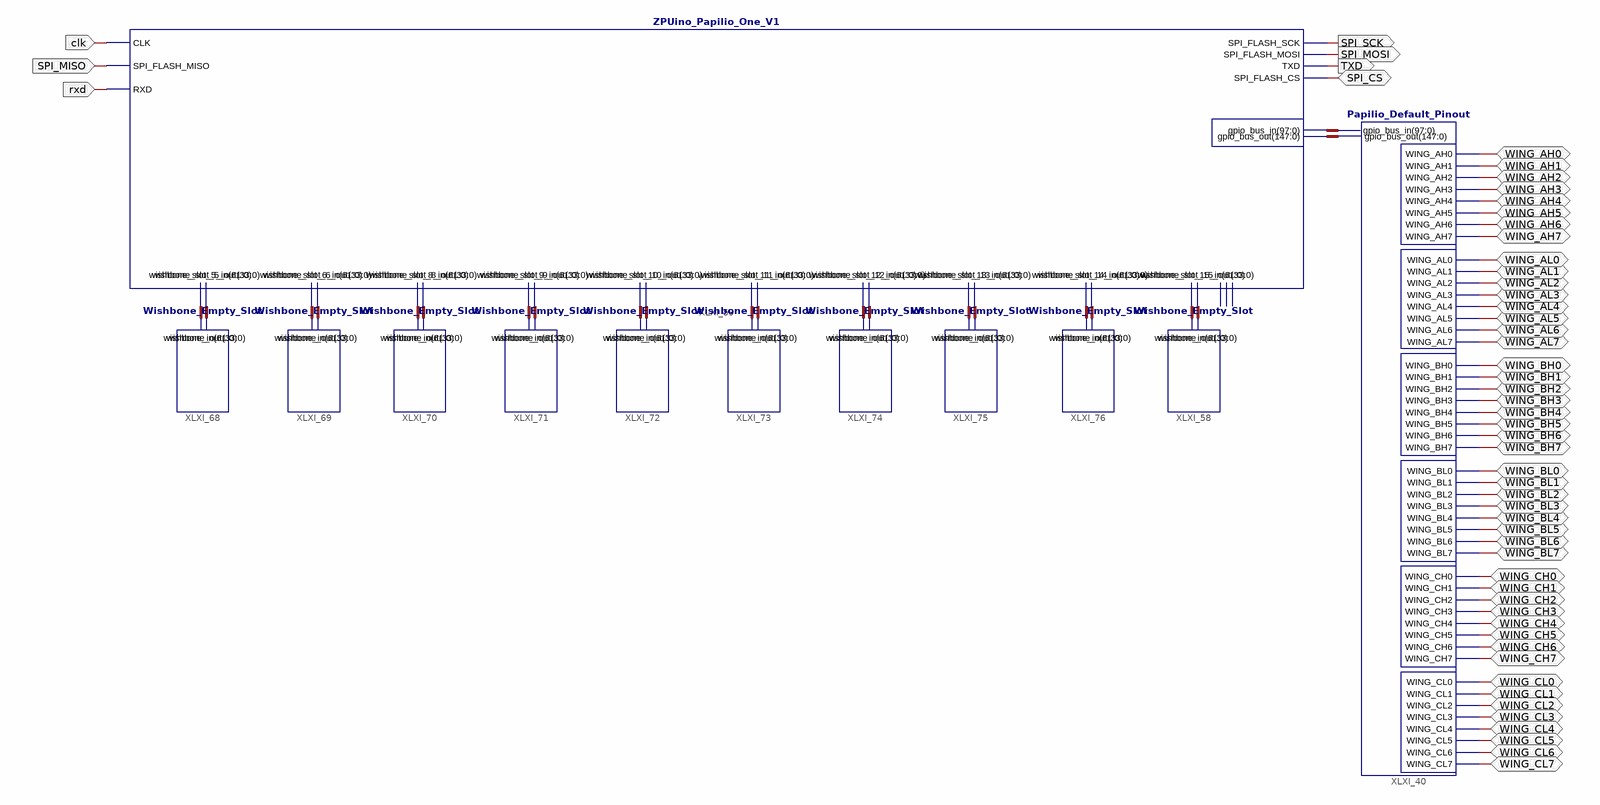
[diagram p0: schematic sheet 1]
// Xilinx ISE schematic Papilio_SOC_Base.sch (spartan3e) as structural Verilog: 12 symbols, 55 ports
module Papilio_SOC_Base (
  input  clk,
  input  SPI_MISO,
  input  rxd,
  inout  SPI_CS,
  inout  WING_AH0,
  inout  WING_AH1,
  inout  WING_AH2,
  inout  WING_AH3,
  inout  WING_AH4,
  inout  WING_AH5,
  inout  WING_AH6,
  inout  WING_AH7,
  inout  WING_BL7,
  inout  WING_BL6,
  inout  WING_BL5,
  inout  WING_BL4,
  inout  WING_BL3,
  inout  WING_BL2,
  inout  WING_BL1,
  inout  WING_BL0,
  inout  WING_BH7,
  inout  WING_BH6,
  inout  WING_BH5,
  inout  WING_BH4,
  inout  WING_BH3,
  inout  WING_BH2,
  inout  WING_BH1,
  inout  WING_BH0,
  inout  WING_AL7,
  inout  WING_AL6,
  inout  WING_AL5,
  inout  WING_AL4,
  inout  WING_AL3,
  inout  WING_AL2,
  inout  WING_AL1,
  inout  WING_AL0,
  inout  WING_CH0,
  inout  WING_CH1,
  inout  WING_CH2,
  inout  WING_CH3,
  inout  WING_CH4,
  inout  WING_CH5,
  inout  WING_CH6,
  inout  WING_CH7,
  inout  WING_CL0,
  inout  WING_CL1,
  inout  WING_CL2,
  inout  WING_CL3,
  inout  WING_CL4,
  inout  WING_CL5,
  inout  WING_CL6,
  inout  WING_CL7,
  output SPI_MOSI,
  output TXD,
  output SPI_SCK
);

  wire [33:0] XLXN_386, XLXN_420, XLXN_422, XLXN_424, XLXN_426, XLXN_428, XLXN_430, XLXN_432, XLXN_434,
       XLXN_436;
  wire [61:0] XLXN_385, XLXN_419, XLXN_421, XLXN_423, XLXN_425, XLXN_427, XLXN_429, XLXN_431, XLXN_433,
       XLXN_435;
  wire [97:0] XLXN_195;
  wire [147:0] XLXN_194;

  Papilio_Default_Pinout XLXI_40 (
    .WING_AH0(WING_AH0), .gpio_bus_out(XLXN_194), .gpio_bus_in(XLXN_195), .WING_AH1(WING_AH1),
    .WING_AH2(WING_AH2), .WING_AH3(WING_AH3), .WING_AH4(WING_AH4), .WING_AH5(WING_AH5), .WING_AH6(WING_AH6),
    .WING_AH7(WING_AH7), .WING_AL0(WING_AL0), .WING_AL1(WING_AL1), .WING_AL2(WING_AL2), .WING_AL3(WING_AL3),
    .WING_AL4(WING_AL4), .WING_AL5(WING_AL5), .WING_AL6(WING_AL6), .WING_AL7(WING_AL7), .WING_BH0(WING_BH0),
    .WING_BH1(WING_BH1), .WING_BH2(WING_BH2), .WING_BH3(WING_BH3), .WING_BH4(WING_BH4), .WING_BH5(WING_BH5),
    .WING_BH6(WING_BH6), .WING_BH7(WING_BH7), .WING_BL0(WING_BL0), .WING_BL1(WING_BL1), .WING_BL2(WING_BL2),
    .WING_BL3(WING_BL3), .WING_BL4(WING_BL4), .WING_BL5(WING_BL5), .WING_BL6(WING_BL6), .WING_BL7(WING_BL7),
    .WING_CH0(WING_CH0), .WING_CH1(WING_CH1), .WING_CH2(WING_CH2), .WING_CH3(WING_CH3), .WING_CH4(WING_CH4),
    .WING_CH5(WING_CH5), .WING_CH6(WING_CH6), .WING_CH7(WING_CH7), .WING_CL0(WING_CL0), .WING_CL1(WING_CL1),
    .WING_CL2(WING_CL2), .WING_CL3(WING_CL3), .WING_CL4(WING_CL4), .WING_CL5(WING_CL5), .WING_CL6(WING_CL6),
    .WING_CL7(WING_CL7));
  Wishbone_Empty_Slot XLXI_58 (.wishbone_in(XLXN_385), .wishbone_out(XLXN_386));
  ZPUino_Papilio_One_V1 XLXI_59 (
    .wishbone_slot_8_in(XLXN_423), .wishbone_slot_8_out(XLXN_424), .wishbone_slot_9_in(XLXN_425),
    .wishbone_slot_9_out(XLXN_426), .wishbone_slot_10_in(XLXN_427), .wishbone_slot_10_out(XLXN_428),
    .wishbone_slot_11_in(XLXN_429), .wishbone_slot_11_out(XLXN_430), .wishbone_slot_12_in(XLXN_431),
    .wishbone_slot_12_out(XLXN_432), .wishbone_slot_13_in(XLXN_433), .wishbone_slot_13_out(XLXN_434),
    .wishbone_slot_14_in(XLXN_435), .wishbone_slot_14_out(XLXN_436), .wishbone_slot_15_in(XLXN_385),
    .wishbone_slot_15_out(XLXN_386), .wishbone_slot_5_out(XLXN_420), .wishbone_slot_5_in(XLXN_419),
    .wishbone_slot_6_in(XLXN_421), .wishbone_slot_6_out(XLXN_422), .SPI_FLASH_SCK(SPI_SCK),
    .SPI_FLASH_MOSI(SPI_MOSI), .TXD(TXD), .SPI_FLASH_CS(SPI_CS), .gpio_bus_out(XLXN_194),
    .gpio_bus_in(XLXN_195), .CLK(clk), .SPI_FLASH_MISO(SPI_MISO), .RXD(rxd));  // open: wishbone_slot_video_in, wishbone_slot_video_out, vgaclkout
  Wishbone_Empty_Slot XLXI_68 (.wishbone_in(XLXN_419), .wishbone_out(XLXN_420));
  Wishbone_Empty_Slot XLXI_69 (.wishbone_in(XLXN_421), .wishbone_out(XLXN_422));
  Wishbone_Empty_Slot XLXI_70 (.wishbone_in(XLXN_423), .wishbone_out(XLXN_424));
  Wishbone_Empty_Slot XLXI_71 (.wishbone_in(XLXN_425), .wishbone_out(XLXN_426));
  Wishbone_Empty_Slot XLXI_72 (.wishbone_in(XLXN_427), .wishbone_out(XLXN_428));
  Wishbone_Empty_Slot XLXI_73 (.wishbone_in(XLXN_429), .wishbone_out(XLXN_430));
  Wishbone_Empty_Slot XLXI_74 (.wishbone_in(XLXN_431), .wishbone_out(XLXN_432));
  Wishbone_Empty_Slot XLXI_75 (.wishbone_in(XLXN_433), .wishbone_out(XLXN_434));
  Wishbone_Empty_Slot XLXI_76 (.wishbone_in(XLXN_435), .wishbone_out(XLXN_436));
endmodule
